# Altium schematic sheet DRV8313EVM.SchDoc
size A4
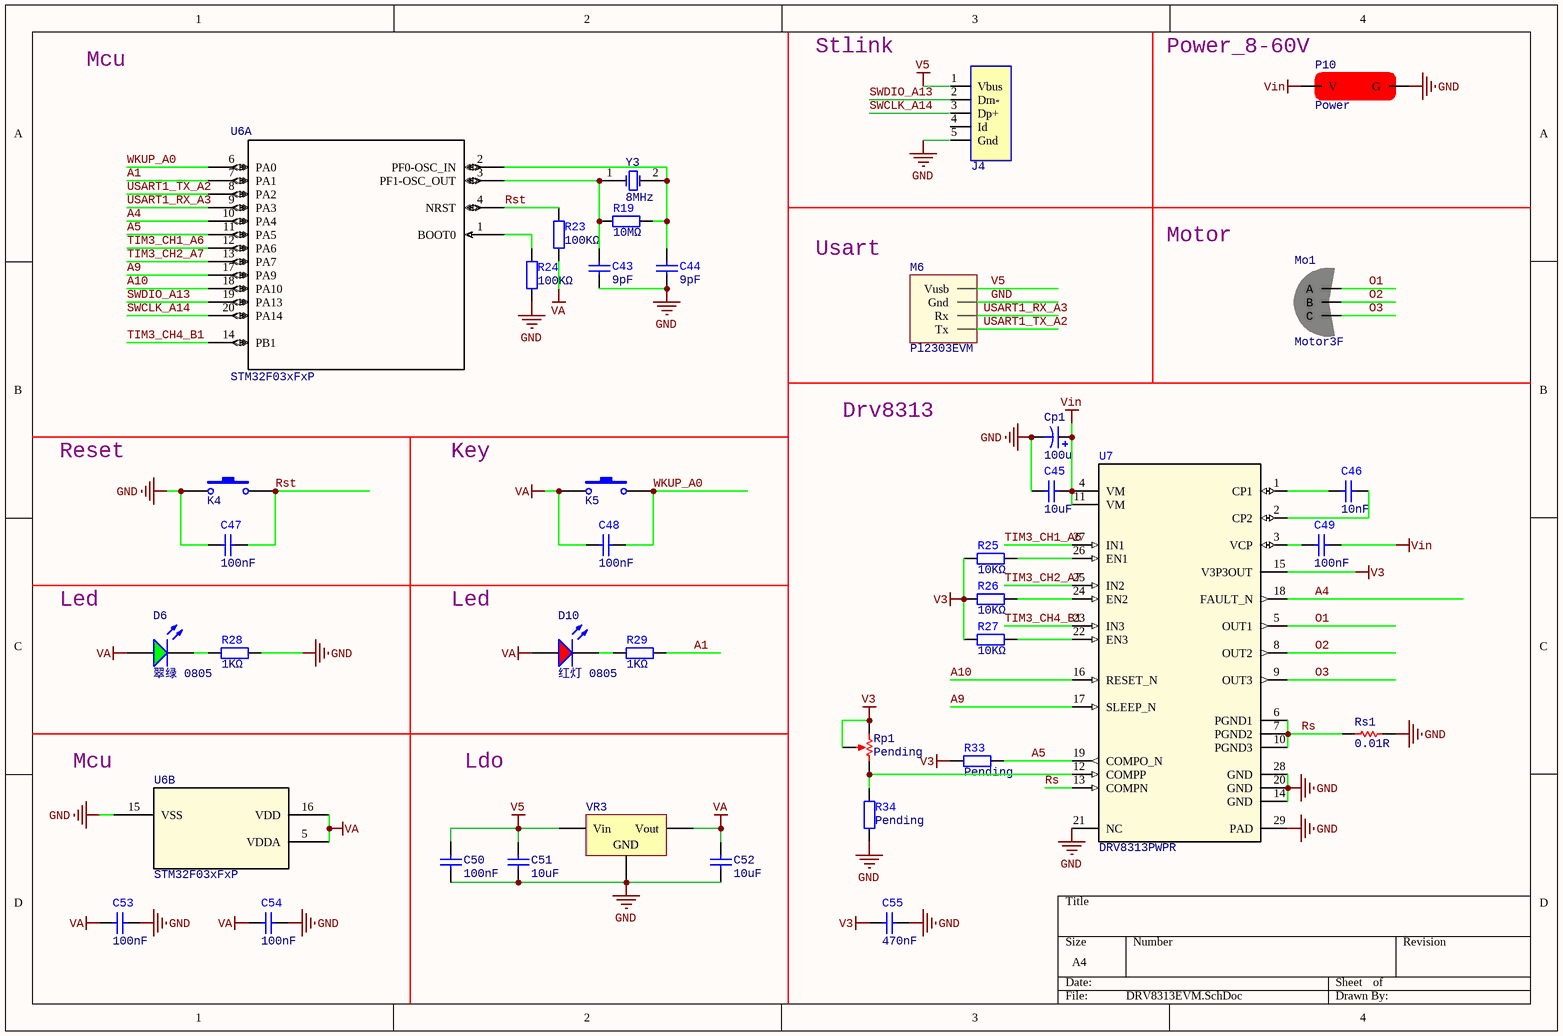
[diagram p0: DRV8313EVM.SchDoc]

## Parts
C43  9pF  [0805_C]
C44  9pF  [0805_C]
C45  10uF  [0805_C]
C46  10nF  [0805_C]
C47  100nF  [0805_C]
C48  100nF  [0805_C]
C49  100nF  [0805_C]
C50  100nF  [0805_C]
C51  10uF  [0805_C]
C52  10uF  [0805_C]
C53  100nF  [0805_C]
C54  100nF  [0805_C]
C55  470nF  [0805_C]
Cp1  100u  [CM D(6.3*5.4)]
D6  翠绿 0805  [0805_LED_S1]
D10  红灯 0805  [0805_LED_S1]
J4  UsbOtg  [USB-MINI-A]  (value not drawn)
K4  SW  [SWITCH]  (value not drawn)
K5  SW  [SWITCH]  (value not drawn)
M6  Pl2303EVM  [PI230203EVM]
Mo1  Motor3F  [Motor_3F]
P10  Power  [DC-005]
R19  10MΩ  [0805_R]
R23  100KΩ  [0805_R]
R24  100KΩ  [0805_R]
R25  10KΩ  [0805_R]
R26  10KΩ  [0805_R]
R27  10KΩ  [0805_R]
R28  1KΩ  [0805_R]
R29  1KΩ  [0805_R]
R33  Pending  [0805_R]
R34  Pending  [0805_R]
Rp1  Pending  [RP3362P]
Rs1  0.01R  [R 2512_L]
U6  STM32F03xFxP  [TSSOP20]  (parts A,B of 2)
U7  DRV8313PWPR  [PWP0028F_L]
VR3  AMS1117-3.3  [SOT-223]  (value not drawn)
Y3  8MHz  [XTAL_US]

## Nets
GND: C43.1 C44.1 C45.1 C47.2 C50.1 C51.1 C52.1 C53.1 C54.1 C55.2 Cp1.2 J4.5(Gnd) K4.1 M6.2(Gnd) P10.2(G) R24.1 R28.1 R34.1 Rs1.2 U6.15(VSS) U7.14(GND) U7.20(GND) U7.21(NC) U7.28(GND) U7.29(PAD) VR3.1(GND)
V3: C55.1 R25.1 R26.1 R27.1 R33.2 Rp1.2(TAP) Rp1.3(TOP) U7.15(V3P3OUT)
V5: C50.2 C51.2 J4.1(Vbus) M6.1(Vusb) VR3.3(Vin)
VA: C48.2 C52.2 C53.2 C54.2 D6.A D10.A K5.1 R23.1 U6.5(VDDA) U6.16(VDD) VR3.2(Vout)
Vin: C45.2 C49.2 Cp1.1 P10.1(V) U7.4(VM) U7.11(VM)
A1: R29.1 U6.7(PA1)
A4: U6.10(PA4) U7.18(FAULT_N)
A5: R33.1 U6.11(PA5) U7.19(COMPO_N)
A9: U6.17(PA9) U7.17(SLEEP_N)
A10: U6.18(PA10) U7.16(RESET_N)
O1: Mo1.1(A) U7.5(OUT1)
O2: Mo1.2(B) U7.8(OUT2)
O3: Mo1.3(C) U7.9(OUT3)
Rs: Rs1.1 U7.6(PGND1) U7.7(PGND2) U7.10(PGND3) U7.13(COMPN)
Rst: C47.1 K4.2 R23.2 U6.4(NRST)
SWCLK_A14: J4.3(Dp+) U6.20(PA14)
SWDIO_A13: J4.2(Dm-) U6.19(PA13)
TIM3_CH1_A6: U6.12(PA6) U7.27(IN1)
TIM3_CH2_A7: U6.13(PA7) U7.25(IN2)
TIM3_CH4_B1: U6.14(PB1) U7.23(IN3)
USART1_RX_A3: M6.3(Rx) U6.9(PA3)
USART1_TX_A2: M6.4(Tx) U6.8(PA2)
WKUP_A0: C48.1 K5.2 U6.6(PA0)
NetC43_2: C43.2 R19.1 U6.3(PF1-OSC_OUT) Y3.1(OSC1)
NetC44_2: C44.2 R19.2 U6.2(PF0-OSC_IN) Y3.2(OSC2)
NetC46_1: C46.1 U7.1(CP1)
NetC46_2: C46.2 U7.2(CP2)
NetC49_1: C49.1 U7.3(VCP)
NetD6_K: D6.K R28.2
NetD10_K: D10.K R29.2
NetR24_2: R24.2 U6.1(BOOT0)
NetR25_2: R25.2 U7.26(EN1)
NetR26_2: R26.2 U7.24(EN2)
NetR27_2: R27.2 U7.22(EN3)
NetR34_2: R34.2 Rp1.1(BOT) U7.12(COMPP)

Not connected (* = marked no-connect by the designer): J4 4(Id)

## Notes on the sheet
- Mcu
- Stlink
- (near P10) Power_8-60V
- Motor
- Usart
- Drv8313
- Reset
- Key
- Led
- Ldo

## Library data of the parts
C43-C49 C53-C55 = 0805 10nF (103) 10% 50V: 贴片电容; ComponentLink1Description: 供应商链接; ComponentLink1URL: http://www.szlcsc.com/product/details_2062.html; Package: 0805; Supplier: LC; SuppliersPartNumber: C1710
C50-C52 = 0805 10uF (106) 10% 25V: 贴片电容; ComponentLink1Description: 供应商链接; ComponentLink1URL: http://www.szlcsc.com/product/details_16532.html; Package: 0805; Supplier: LC; SuppliersPartNumber: C15850
Cp1 = Cp: Polarized Capacitor (Axial); Published: 8-Jun-2000; LatestRevisionDate: 17-Jul-2002; LatestRevisionNote: Re-released for DXP Platform.; PackageReference: POLAR0.8; Publisher: Altium Limited; PackageDescription: Polarized Capacitor; 2 Leads
D6 = 0805 翠绿: 发光二极管; ComponentLink1Description: 供应商链接; ComponentLink1URL: http://www.szlcsc.com/product/details_2670.html; Package: 0805; Supplier: LC; SuppliersPartNumber: C2297
D10 = 0805 红灯: 发光二极管; ComponentLink1Description: 供应商链接; ComponentLink1URL: http://www.szlcsc.com/product/details_2668.html; Package: 0805; Supplier: LC; SuppliersPartNumber: C2295
K4 K5 = SW: Switch
R19 R23-R29 R33 R34 = 0805 10KΩ (1002) 1%: 贴片电阻; ComponentLink1Description: 供应商链接; ComponentLink1URL: http://www.szlcsc.com/product/details_18102.html; Package: 0805; Supplier: LC; SuppliersPartNumber: C17414
Rp1 = Rp: Potentiometer; Sim Note: Enter the Resistance value and the set point into parameter fields.; Set Position: 0.5; Published: 8-Jun-2000; LatestRevisionDate: 17-Jul-2002; LatestRevisionNote: Re-released for DXP Platform.; PackageReference: VR5; Publisher: Altium Limited; PackageDescription: Variable Resistor, Thru-Hole; 3 Leads
Rs1 = Rs
U6 = STM32F03xFxP: Mcu; Vendor: STMicroelectronics; C: Copyright (C) 2016 Accelerated Designs. All rights reserved; Copyright: Copyright (C) 2016 Accelerated Designs. All rights reserved; Manufacturer_Part_Number: stm32f03xfxp; RefDes: RefDes; Type: Type; Value: Value
U7 = DRV8313PWPR: Imported; Manufacturer: Texas Instruments; PartNumber: DRV8313PWPR; RefDes: RefDes; TYPE: TYPE; Value: Value
VR3 = SOT-223 AMS1117-3.3: 低压差线性稳压(LDO); ComponentLink1Description: 供应商链接; ComponentLink1URL: http://www.szlcsc.com/product/details_6652.html; Package: SOT-223; Supplier: LC; SuppliersPartNumber: C6186
Y3 = XTAL: Crystal Oscillator; Published: 8-Jun-2000; LatestRevisionDate: 17-Jul-2002; LatestRevisionNote: Re-released for DXP Platform.; Publisher: Altium Limited